# Altium schematic sheet A200T FPGA.SchDoc
size A1; SheetNumber: 3; SheetTotal: 3
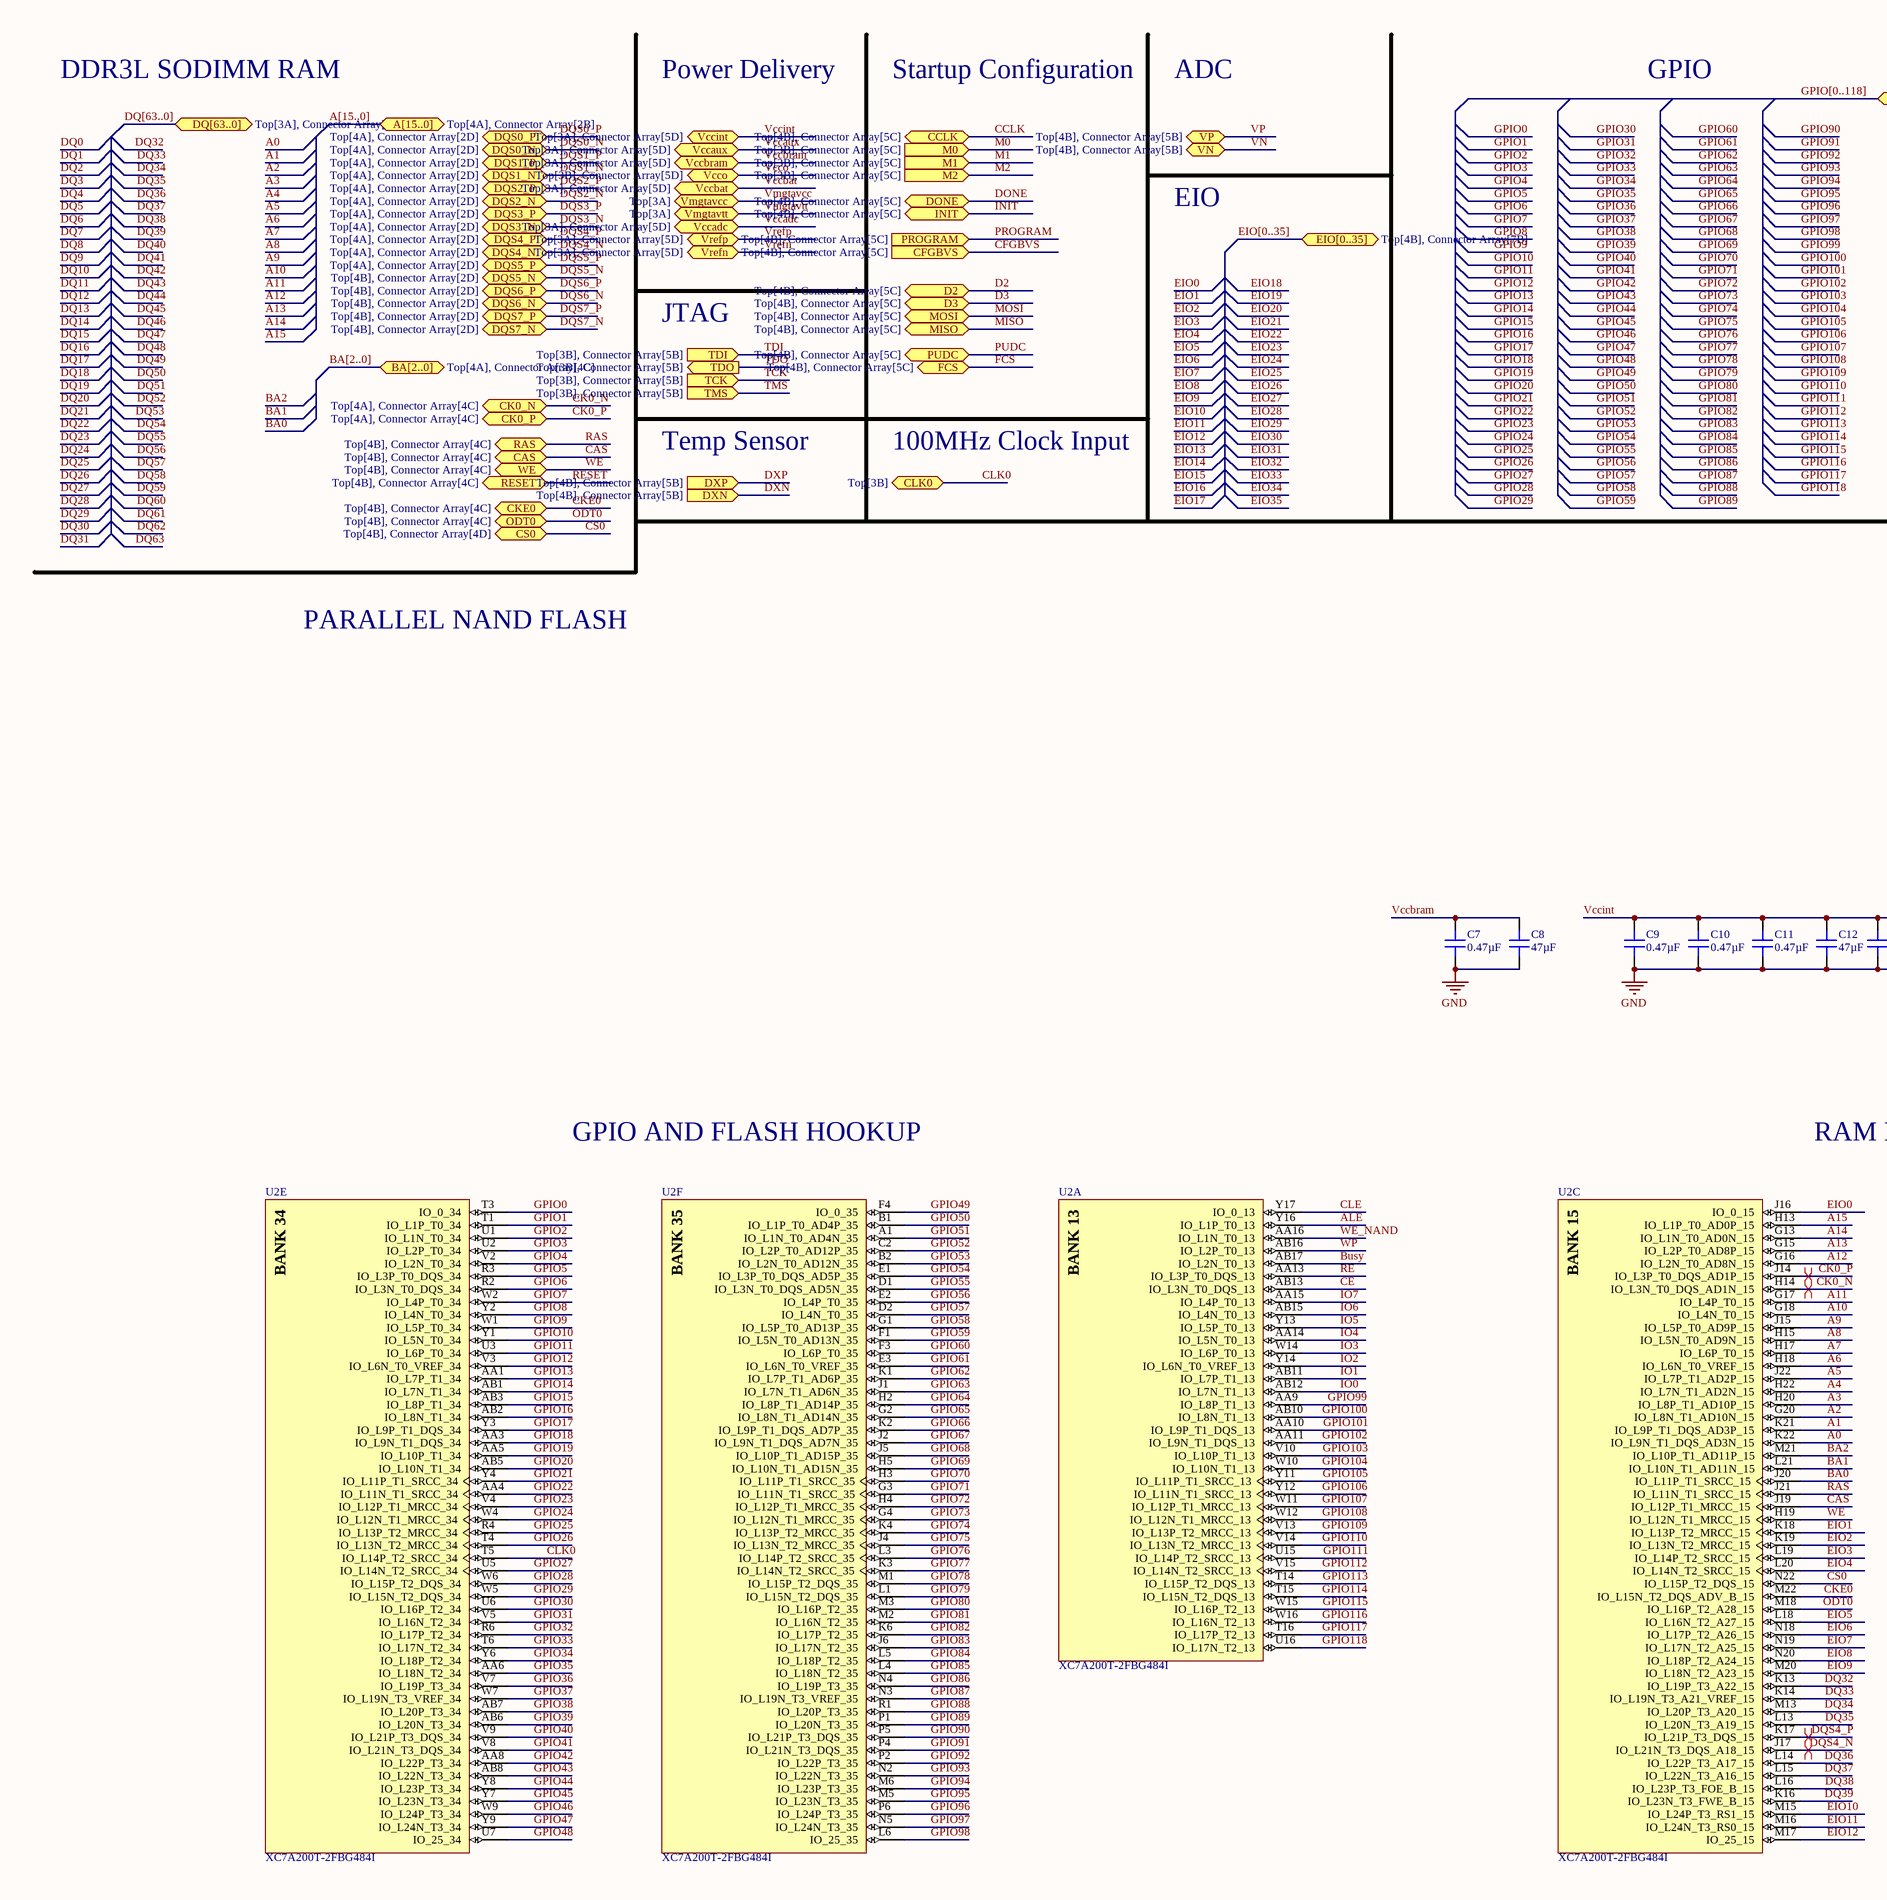
[diagram p0: A200T FPGA.SchDoc, left]
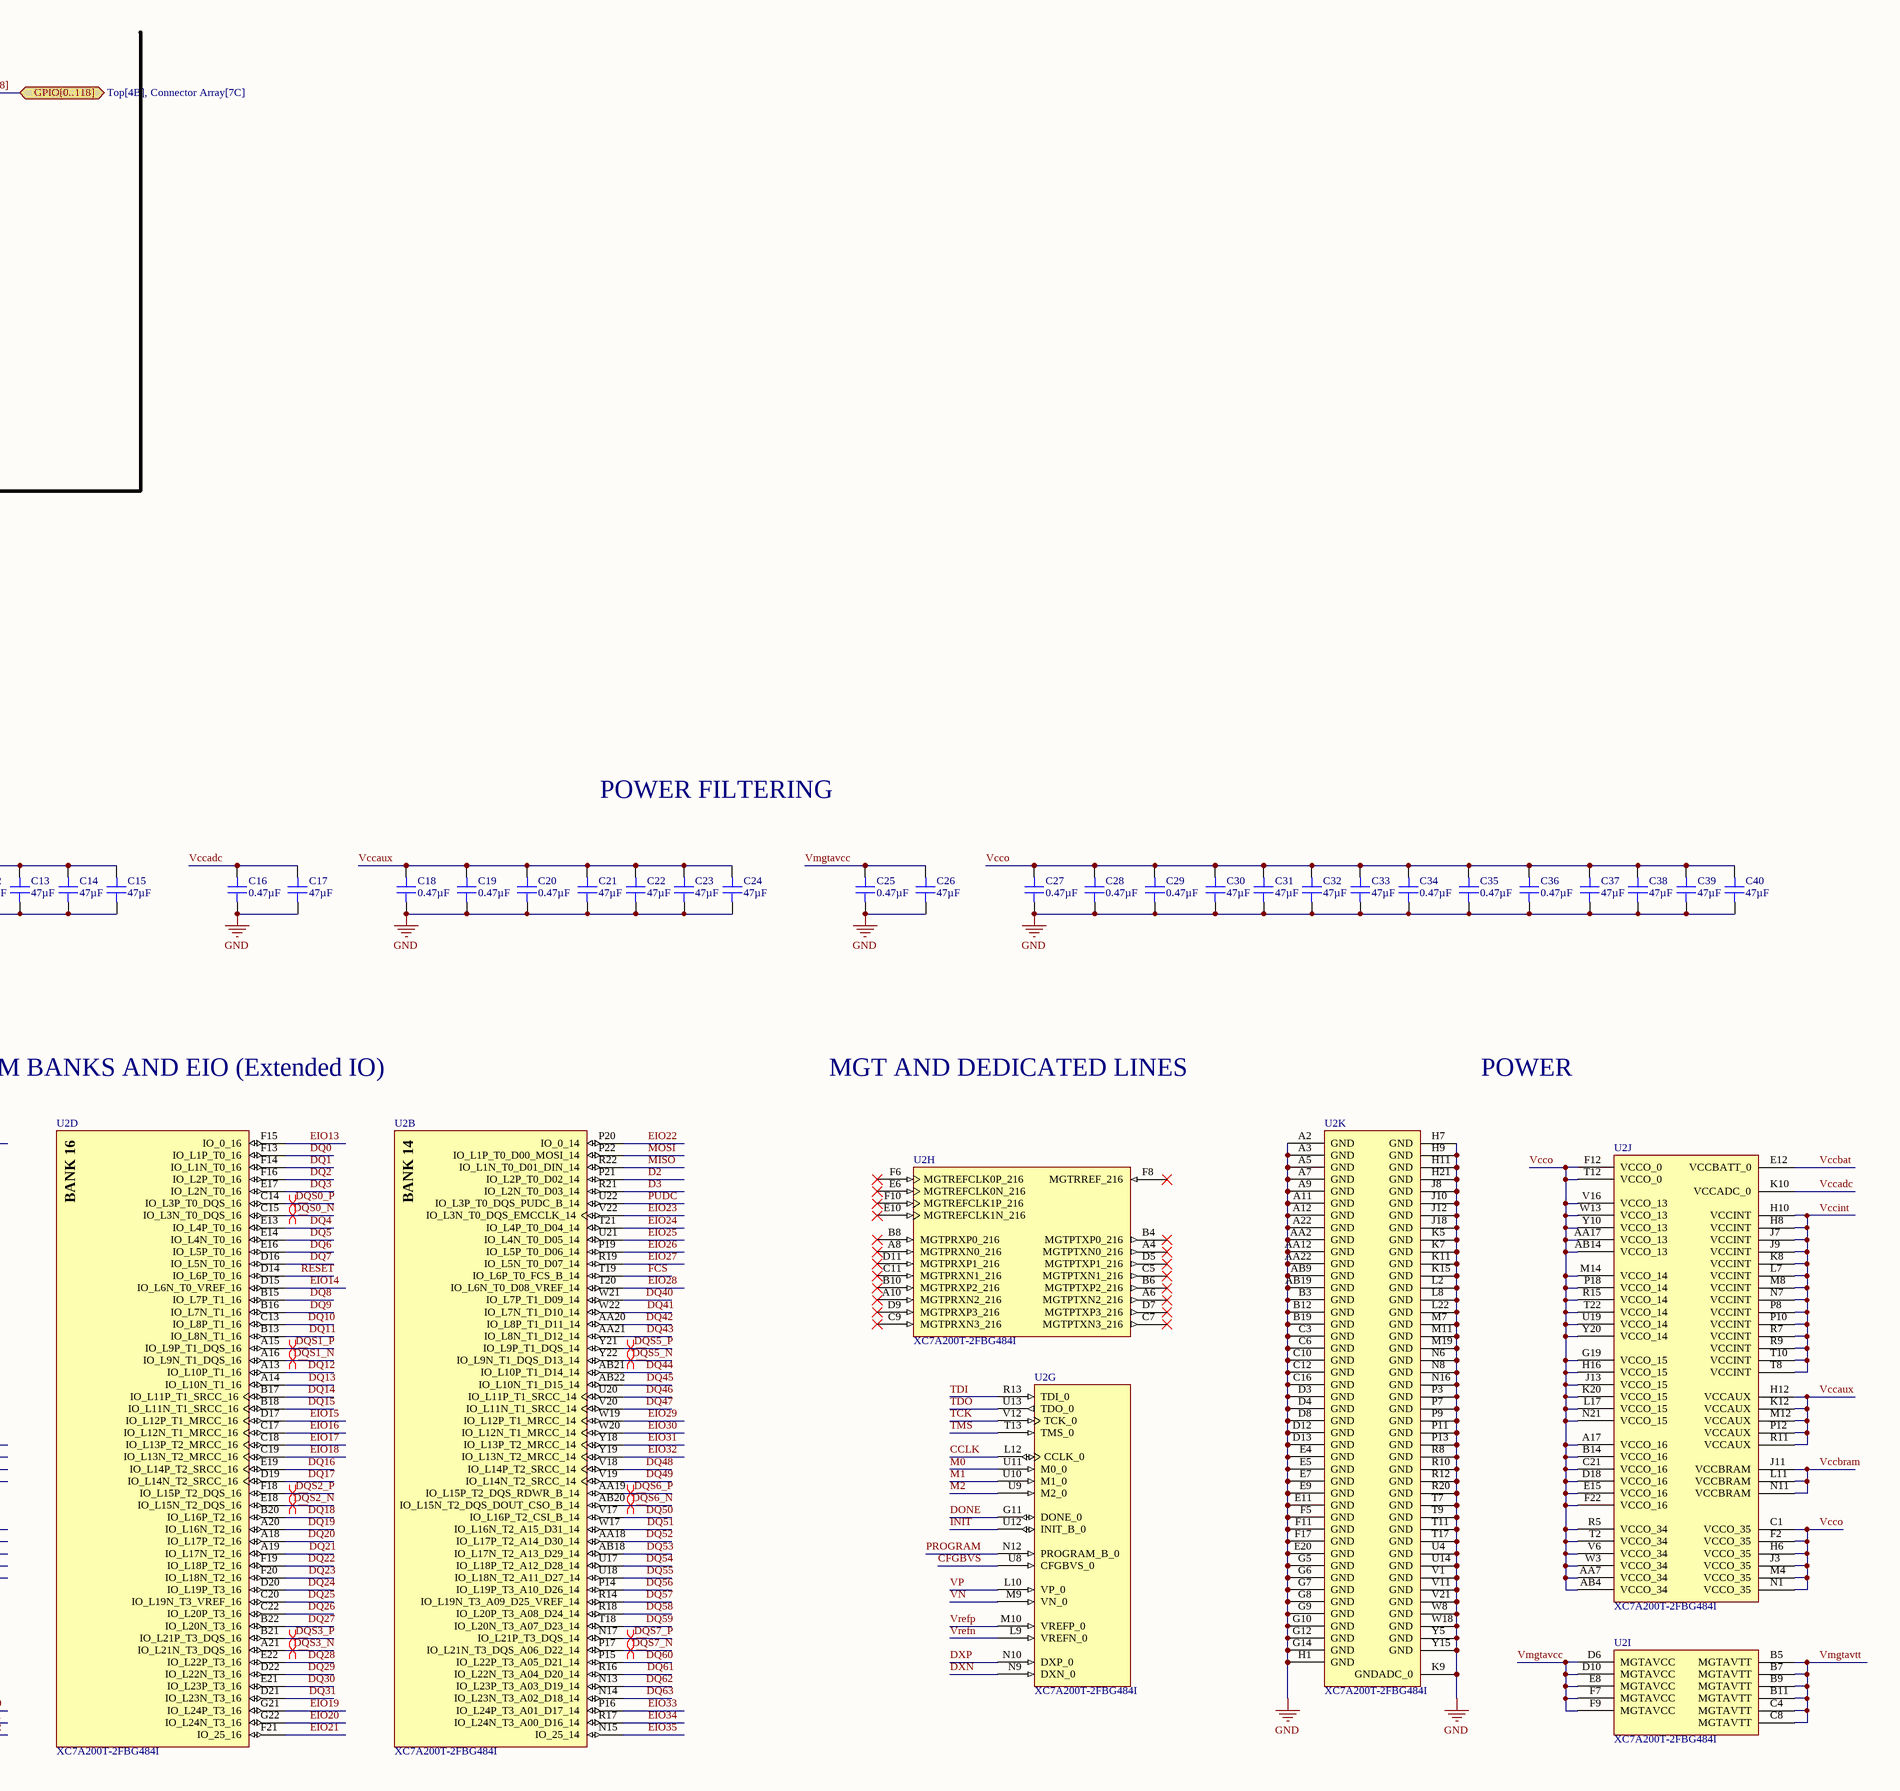
[diagram p1: A200T FPGA.SchDoc, right]

## Parts
C7  0.47µF  [CAP 0603_1608]
C8  47µF  [CAP 0805_2012]
C9  0.47µF  [CAP 0603_1608]
C10  0.47µF  [CAP 0603_1608]
C11  0.47µF  [CAP 0603_1608]
C12  47µF  [CAP 0805_2012]
C13  47µF  [CAP 0805_2012]
C14  47µF  [CAP 0805_2012]
C15  47µF  [CAP 0805_2012]
C16  0.47µF  [CAP 0603_1608]
C17  47µF  [CAP 0805_2012]
C18  0.47µF  [CAP 0603_1608]
C19  0.47µF  [CAP 0603_1608]
C20  0.47µF  [CAP 0603_1608]
C21  47µF  [CAP 0805_2012]
C22  47µF  [CAP 0805_2012]
C23  47µF  [CAP 0805_2012]
C24  47µF  [CAP 0805_2012]
C25  0.47µF  [CAP 0603_1608]
C26  47µF  [CAP 0805_2012]
C27  0.47µF  [CAP 0603_1608]
C28  0.47µF  [CAP 0603_1608]
C29  0.47µF  [CAP 0603_1608]
C30  47µF  [CAP 0805_2012]
C31  47µF  [CAP 0805_2012]
C32  47µF  [CAP 0805_2012]
C33  47µF  [CAP 0805_2012]
C34  0.47µF  [CAP 0603_1608]
C35  0.47µF  [CAP 0603_1608]
C36  0.47µF  [CAP 0603_1608]
C37  47µF  [CAP 0805_2012]
C38  47µF  [CAP 0805_2012]
C39  47µF  [CAP 0805_2012]
C40  47µF  [CAP 0805_2012]
U2  XC7A200T-2FBG484I  [FBG484]  (parts A,B,C,D,E,F,G,H,I,J,K of 11)

## Ports
A[15..0] (bidir, see Top[4A], Connector Array[2B]), BA[2..0] (bidir, see Top[4A], Connector Array[4C]), CAS (bidir, see Top[4B], Connector Array[4C]), CCLK (bidir, see Top[4B], Connector Array[5C]), CFGBVS (in, see Top[4B], Connector Array[5C]), CK0_N (bidir, see Top[4A], Connector Array[4C]), CK0_P (bidir, see Top[4A], Connector Array[4C]), CKE0 (bidir, see Top[4B], Connector Array[4C]), CLK0 (bidir, see Top[3B]), CS0 (bidir, see Top[4B], Connector Array[4D]), D2 (bidir, see Top[4B], Connector Array[5C]), D3 (bidir, see Top[4B], Connector Array[5C]), DONE (bidir, see Top[4B], Connector Array[5C]), DQ[63..0] (bidir, see Top[3A], Connector Array[2C]), DQS0_N (bidir, see Top[4A], Connector Array[2D]), DQS0_P (bidir, see Top[4A], Connector Array[2D]), DQS1_N (bidir, see Top[4A], Connector Array[2D]), DQS1_P (bidir, see Top[4A], Connector Array[2D]), DQS2_N (bidir, see Top[4A], Connector Array[2D]), DQS2_P (bidir, see Top[4A], Connector Array[2D]), DQS3_N (bidir, see Top[4A], Connector Array[2D]), DQS3_P (bidir, see Top[4A], Connector Array[2D]), DQS4_N (bidir, see Top[4A], Connector Array[2D]), DQS4_P (bidir, see Top[4A], Connector Array[2D]), DQS5_N (bidir, see Top[4B], Connector Array[2D]), DQS5_P (bidir, see Top[4A], Connector Array[2D]), DQS6_N (bidir, see Top[4B], Connector Array[2D]), DQS6_P (bidir, see Top[4B], Connector Array[2D]), DQS7_N (bidir, see Top[4B], Connector Array[2D]), DQS7_P (bidir, see Top[4B], Connector Array[2D]), DXN (in, see Top[4B], Connector Array[5B]), DXP (in, see Top[4B], Connector Array[5B]), EIO[0..35] (bidir, see Top[4B], Connector Array[7B]), FCS (bidir, see Top[4B], Connector Array[5C]), GPIO[0..118] (bidir, see Top[4B], Connector Array[7C]), INIT (bidir, see Top[4B], Connector Array[5C]), M0 (in, see Top[3B], Connector Array[5C]), M1 (in, see Top[3B], Connector Array[5C]), M2 (in, see Top[3B], Connector Array[5C]), MISO (bidir, see Top[4B], Connector Array[5C]), MOSI (bidir, see Top[4B], Connector Array[5C]), ODT0 (bidir, see Top[4B], Connector Array[4C]), PROGRAM (in, see Top[4B], Connector Array[5C]), PUDC (bidir, see Top[4B], Connector Array[5C]), RAS (bidir, see Top[4B], Connector Array[4C]), RESET (bidir, see Top[4B], Connector Array[4C]), TCK (in, see Top[3B], Connector Array[5B]), TDI (in, see Top[3B], Connector Array[5B]), TDO (out, see Top[3B], Connector Array[5B]), TMS (in, see Top[3B], Connector Array[5B]), Vccadc (bidir, see Top[3A], Connector Array[5D]), Vccaux (bidir, see Top[3A], Connector Array[5D]), Vccbat (bidir, see Top[3A], Connector Array[5D]), Vccbram (bidir, see Top[3A], Connector Array[5D]), Vccint (bidir, see Top[3A], Connector Array[5D]), Vcco (bidir, see Top[3B], Connector Array[5D]), Vmgtavcc (bidir, see Top[3A]), Vmgtavtt (bidir, see Top[3A]), VN (bidir, see Top[4B], Connector Array[5B]), VP (bidir, see Top[4B], Connector Array[5B]), Vrefn (bidir, see Top[3A], Connector Array[5D]), Vrefp (bidir, see Top[3A], Connector Array[5D]), WE (bidir, see Top[4B], Connector Array[4C])

## Nets
GND: C7.1 C8.1 C9.1 C10.1 C11.1 C12.1 C13.1 C14.1 C15.1 C16.1 C17.1 C18.1 C19.1 C20.1 C21.1 C22.1 C23.1 C24.1 C25.1 C26.1 C27.1 C28.1 C29.1 C30.1 C31.1 C32.1 C33.1 C34.1 C35.1 C36.1 C37.1 C38.1 C39.1 C40.1 U2.A2(GND) U2.A3(GND) U2.A5(GND) U2.A7(GND) U2.A9(GND) U2.A11(GND) U2.A12(GND) U2.A22(GND) U2.AA2(GND) U2.AA12(GND) U2.AA22(GND) U2.AB9(GND) U2.AB19(GND) U2.B3(GND) U2.B12(GND) U2.B19(GND) U2.C3(GND) U2.C6(GND) U2.C10(GND) U2.C12(GND) U2.C16(GND) U2.D3(GND) U2.D4(GND) U2.D8(GND) U2.D12(GND) U2.D13(GND) U2.E4(GND) U2.E5(GND) U2.E7(GND) U2.E9(GND) U2.E11(GND) U2.E20(GND) U2.F5(GND) U2.F11(GND) U2.F17(GND) U2.G5(GND) U2.G6(GND) U2.G7(GND) U2.G8(GND) U2.G9(GND) U2.G10(GND) U2.G12(GND) U2.G14(GND) U2.H1(GND) U2.H7(GND) U2.H9(GND) U2.H11(GND) U2.H21(GND) U2.J8(GND) U2.J10(GND) U2.J12(GND) U2.J18(GND) U2.K5(GND) U2.K7(GND) U2.K9(GNDADC_0) U2.K11(GND) U2.K15(GND) U2.L2(GND) U2.L8(GND) U2.L22(GND) U2.M7(GND) U2.M11(GND) U2.M19(GND) U2.N6(GND) U2.N8(GND) U2.N16(GND) U2.P3(GND) U2.P7(GND) U2.P9(GND) U2.P11(GND) U2.P13(GND) U2.R8(GND) U2.R10(GND) U2.R12(GND) U2.R20(GND) U2.T7(GND) U2.T9(GND) U2.T11(GND) U2.T17(GND) U2.U4(GND) U2.U14(GND) U2.V1(GND) U2.V11(GND) U2.V21(GND) U2.W8(GND) U2.W18(GND) U2.Y5(GND) U2.Y15(GND)
A0: U2.K22(IO_L9N_T1_DQS_AD3N_15)
A1: U2.K21(IO_L9P_T1_DQS_AD3P_15)
A2: U2.G20(IO_L8N_T1_AD10N_15)
A3: U2.H20(IO_L8P_T1_AD10P_15)
A4: U2.H22(IO_L7N_T1_AD2N_15)
A5: U2.J22(IO_L7P_T1_AD2P_15)
A6: U2.H18(IO_L6N_T0_VREF_15)
A7: U2.H17(IO_L6P_T0_15)
A8: U2.H15(IO_L5N_T0_AD9N_15)
A9: U2.J15(IO_L5P_T0_AD9P_15)
A10: U2.G18(IO_L4N_T0_15)
A11: U2.G17(IO_L4P_T0_15)
A12: U2.G16(IO_L2N_T0_AD8N_15)
A13: U2.G15(IO_L2P_T0_AD8P_15)
A14: U2.G13(IO_L1N_T0_AD0N_15)
A15: U2.H13(IO_L1P_T0_AD0P_15)
ALE: U2.Y16(IO_L1P_T0_13)
BA0: U2.J20(IO_L11P_T1_SRCC_15)
BA1: U2.L21(IO_L10N_T1_AD11N_15)
BA2: U2.M21(IO_L10P_T1_AD11P_15)
Busy: U2.AB17(IO_L2N_T0_13)
CAS: U2.J19(IO_L12P_T1_MRCC_15) ; port CAS
CCLK: U2.L12(CCLK_0) ; port CCLK
CE: U2.AB13(IO_L3N_T0_DQS_13)
CFGBVS: U2.U8(CFGBVS_0) ; port CFGBVS
CK0_N: U2.H14(IO_L3N_T0_DQS_AD1N_15) ; port CK0_N
CK0_P: U2.J14(IO_L3P_T0_DQS_AD1P_15) ; port CK0_P
CKE0: U2.M22(IO_L15N_T2_DQS_ADV_B_15) ; port CKE0
CLE: U2.Y17(IO_0_13)
CLK0: U2.T5(IO_L14P_T2_SRCC_34) ; port CLK0
CS0: U2.N22(IO_L15P_T2_DQS_15) ; port CS0
D2: U2.P21(IO_L2P_T0_D02_14) ; port D2
D3: U2.R21(IO_L2N_T0_D03_14) ; port D3
DONE: U2.G11(DONE_0) ; port DONE
DQ0: U2.F13(IO_L1P_T0_16)
DQ1: U2.F14(IO_L1N_T0_16)
DQ2: U2.F16(IO_L2P_T0_16)
DQ3: U2.E17(IO_L2N_T0_16)
DQ4: U2.E13(IO_L4P_T0_16)
DQ5: U2.E14(IO_L4N_T0_16)
DQ6: U2.E16(IO_L5P_T0_16)
DQ7: U2.D16(IO_L5N_T0_16)
DQ8: U2.B15(IO_L7P_T1_16)
DQ9: U2.B16(IO_L7N_T1_16)
DQ10: U2.C13(IO_L8P_T1_16)
DQ11: U2.B13(IO_L8N_T1_16)
DQ12: U2.A13(IO_L10P_T1_16)
DQ13: U2.A14(IO_L10N_T1_16)
DQ14: U2.B17(IO_L11P_T1_SRCC_16)
DQ15: U2.B18(IO_L11N_T1_SRCC_16)
DQ16: U2.E19(IO_L14P_T2_SRCC_16)
DQ17: U2.D19(IO_L14N_T2_SRCC_16)
DQ18: U2.B20(IO_L16P_T2_16)
DQ19: U2.A20(IO_L16N_T2_16)
DQ20: U2.A18(IO_L17P_T2_16)
DQ21: U2.A19(IO_L17N_T2_16)
DQ22: U2.F19(IO_L18P_T2_16)
DQ23: U2.F20(IO_L18N_T2_16)
DQ24: U2.D20(IO_L19P_T3_16)
DQ25: U2.C20(IO_L19N_T3_VREF_16)
DQ26: U2.C22(IO_L20P_T3_16)
DQ27: U2.B22(IO_L20N_T3_16)
DQ28: U2.E22(IO_L22P_T3_16)
DQ29: U2.D22(IO_L22N_T3_16)
DQ30: U2.E21(IO_L23P_T3_16)
DQ31: U2.D21(IO_L23N_T3_16)
DQ32: U2.K13(IO_L19P_T3_A22_15)
DQ33: U2.K14(IO_L19N_T3_A21_VREF_15)
DQ34: U2.M13(IO_L20P_T3_A20_15)
DQ35: U2.L13(IO_L20N_T3_A19_15)
DQ36: U2.L14(IO_L22P_T3_A17_15)
DQ37: U2.L15(IO_L22N_T3_A16_15)
DQ38: U2.L16(IO_L23P_T3_FOE_B_15)
DQ39: U2.K16(IO_L23N_T3_FWE_B_15)
DQ40: U2.W21(IO_L7P_T1_D09_14)
DQ41: U2.W22(IO_L7N_T1_D10_14)
DQ42: U2.AA20(IO_L8P_T1_D11_14)
DQ43: U2.AA21(IO_L8N_T1_D12_14)
DQ44: U2.AB21(IO_L10P_T1_D14_14)
DQ45: U2.AB22(IO_L10N_T1_D15_14)
DQ46: U2.U20(IO_L11P_T1_SRCC_14)
DQ47: U2.V20(IO_L11N_T1_SRCC_14)
DQ48: U2.V18(IO_L14P_T2_SRCC_14)
DQ49: U2.V19(IO_L14N_T2_SRCC_14)
DQ50: U2.V17(IO_L16P_T2_CSI_B_14)
DQ51: U2.W17(IO_L16N_T2_A15_D31_14)
DQ52: U2.AA18(IO_L17P_T2_A14_D30_14)
DQ53: U2.AB18(IO_L17N_T2_A13_D29_14)
DQ54: U2.U17(IO_L18P_T2_A12_D28_14)
DQ55: U2.U18(IO_L18N_T2_A11_D27_14)
DQ56: U2.P14(IO_L19P_T3_A10_D26_14)
DQ57: U2.R14(IO_L19N_T3_A09_D25_VREF_14)
DQ58: U2.R18(IO_L20P_T3_A08_D24_14)
DQ59: U2.T18(IO_L20N_T3_A07_D23_14)
DQ60: U2.P15(IO_L22P_T3_A05_D21_14)
DQ61: U2.R16(IO_L22N_T3_A04_D20_14)
DQ62: U2.N13(IO_L23P_T3_A03_D19_14)
DQ63: U2.N14(IO_L23N_T3_A02_D18_14)
DQS0_N: U2.C15(IO_L3N_T0_DQS_16) ; port DQS0_N
DQS0_P: U2.C14(IO_L3P_T0_DQS_16) ; port DQS0_P
DQS1_N: U2.A16(IO_L9N_T1_DQS_16) ; port DQS1_N
DQS1_P: U2.A15(IO_L9P_T1_DQS_16) ; port DQS1_P
DQS2_N: U2.E18(IO_L15N_T2_DQS_16) ; port DQS2_N
DQS2_P: U2.F18(IO_L15P_T2_DQS_16) ; port DQS2_P
DQS3_N: U2.A21(IO_L21N_T3_DQS_16) ; port DQS3_N
DQS3_P: U2.B21(IO_L21P_T3_DQS_16) ; port DQS3_P
DQS4_N: U2.J17(IO_L21N_T3_DQS_A18_15) ; port DQS4_N
DQS4_P: U2.K17(IO_L21P_T3_DQS_15) ; port DQS4_P
DQS5_N: U2.Y22(IO_L9N_T1_DQS_D13_14) ; port DQS5_N
DQS5_P: U2.Y21(IO_L9P_T1_DQS_14) ; port DQS5_P
DQS6_N: U2.AB20(IO_L15N_T2_DQS_DOUT_CSO_B_14) ; port DQS6_N
DQS6_P: U2.AA19(IO_L15P_T2_DQS_RDWR_B_14) ; port DQS6_P
DQS7_N: U2.P17(IO_L21N_T3_DQS_A06_D22_14) ; port DQS7_N
DQS7_P: U2.N17(IO_L21P_T3_DQS_14) ; port DQS7_P
DXN: U2.N9(DXN_0) ; port DXN
DXP: U2.N10(DXP_0) ; port DXP
EIO0: U2.J16(IO_0_15)
EIO1: U2.K18(IO_L13P_T2_MRCC_15)
EIO2: U2.K19(IO_L13N_T2_MRCC_15)
EIO3: U2.L19(IO_L14P_T2_SRCC_15)
EIO4: U2.L20(IO_L14N_T2_SRCC_15)
EIO5: U2.L18(IO_L16N_T2_A27_15)
EIO6: U2.N18(IO_L17P_T2_A26_15)
EIO7: U2.N19(IO_L17N_T2_A25_15)
EIO8: U2.N20(IO_L18P_T2_A24_15)
EIO9: U2.M20(IO_L18N_T2_A23_15)
EIO10: U2.M15(IO_L24P_T3_RS1_15)
EIO11: U2.M16(IO_L24N_T3_RS0_15)
EIO12: U2.M17(IO_25_15)
EIO13: U2.F15(IO_0_16)
EIO14: U2.D15(IO_L6N_T0_VREF_16)
EIO15: U2.D17(IO_L12P_T1_MRCC_16)
EIO16: U2.C17(IO_L12N_T1_MRCC_16)
EIO17: U2.C18(IO_L13P_T2_MRCC_16)
EIO18: U2.C19(IO_L13N_T2_MRCC_16)
EIO19: U2.G21(IO_L24P_T3_16)
EIO20: U2.G22(IO_L24N_T3_16)
EIO21: U2.F21(IO_25_16)
EIO22: U2.P20(IO_0_14)
EIO23: U2.V22(IO_L3N_T0_DQS_EMCCLK_14)
EIO24: U2.T21(IO_L4P_T0_D04_14)
EIO25: U2.U21(IO_L4N_T0_D05_14)
EIO26: U2.P19(IO_L5P_T0_D06_14)
EIO27: U2.R19(IO_L5N_T0_D07_14)
EIO28: U2.T20(IO_L6N_T0_D08_VREF_14)
EIO29: U2.W19(IO_L12P_T1_MRCC_14)
EIO30: U2.W20(IO_L12N_T1_MRCC_14)
EIO31: U2.Y18(IO_L13P_T2_MRCC_14)
EIO32: U2.Y19(IO_L13N_T2_MRCC_14)
EIO33: U2.P16(IO_L24P_T3_A01_D17_14)
EIO34: U2.R17(IO_L24N_T3_A00_D16_14)
EIO35: U2.N15(IO_25_14)
FCS: U2.T19(IO_L6P_T0_FCS_B_14) ; port FCS
GPIO0: U2.T3(IO_0_34)
GPIO1: U2.T1(IO_L1P_T0_34)
GPIO2: U2.U1(IO_L1N_T0_34)
GPIO3: U2.U2(IO_L2P_T0_34)
GPIO4: U2.V2(IO_L2N_T0_34)
GPIO5: U2.R3(IO_L3P_T0_DQS_34)
GPIO6: U2.R2(IO_L3N_T0_DQS_34)
GPIO7: U2.W2(IO_L4P_T0_34)
GPIO8: U2.Y2(IO_L4N_T0_34)
GPIO9: U2.W1(IO_L5P_T0_34)
GPIO10: U2.Y1(IO_L5N_T0_34)
GPIO11: U2.U3(IO_L6P_T0_34)
GPIO12: U2.V3(IO_L6N_T0_VREF_34)
GPIO13: U2.AA1(IO_L7P_T1_34)
GPIO14: U2.AB1(IO_L7N_T1_34)
GPIO15: U2.AB3(IO_L8P_T1_34)
GPIO16: U2.AB2(IO_L8N_T1_34)
GPIO17: U2.Y3(IO_L9P_T1_DQS_34)
GPIO18: U2.AA3(IO_L9N_T1_DQS_34)
GPIO19: U2.AA5(IO_L10P_T1_34)
GPIO20: U2.AB5(IO_L10N_T1_34)
GPIO21: U2.Y4(IO_L11P_T1_SRCC_34)
GPIO22: U2.AA4(IO_L11N_T1_SRCC_34)
GPIO23: U2.V4(IO_L12P_T1_MRCC_34)
GPIO24: U2.W4(IO_L12N_T1_MRCC_34)
GPIO25: U2.R4(IO_L13P_T2_MRCC_34)
GPIO26: U2.T4(IO_L13N_T2_MRCC_34)
GPIO27: U2.U5(IO_L14N_T2_SRCC_34)
GPIO28: U2.W6(IO_L15P_T2_DQS_34)
GPIO29: U2.W5(IO_L15N_T2_DQS_34)
GPIO30: U2.U6(IO_L16P_T2_34)
GPIO31: U2.V5(IO_L16N_T2_34)
GPIO32: U2.R6(IO_L17P_T2_34)
GPIO33: U2.T6(IO_L17N_T2_34)
GPIO34: U2.Y6(IO_L18P_T2_34)
GPIO35: U2.AA6(IO_L18N_T2_34)
GPIO36: U2.V7(IO_L19P_T3_34)
GPIO37: U2.W7(IO_L19N_T3_VREF_34)
GPIO38: U2.AB7(IO_L20P_T3_34)
GPIO39: U2.AB6(IO_L20N_T3_34)
GPIO40: U2.V9(IO_L21P_T3_DQS_34)
GPIO41: U2.V8(IO_L21N_T3_DQS_34)
GPIO42: U2.AA8(IO_L22P_T3_34)
GPIO43: U2.AB8(IO_L22N_T3_34)
GPIO44: U2.Y8(IO_L23P_T3_34)
GPIO45: U2.Y7(IO_L23N_T3_34)
GPIO46: U2.W9(IO_L24P_T3_34)
GPIO47: U2.Y9(IO_L24N_T3_34)
GPIO48: U2.U7(IO_25_34)
GPIO49: U2.F4(IO_0_35)
GPIO50: U2.B1(IO_L1P_T0_AD4P_35)
GPIO51: U2.A1(IO_L1N_T0_AD4N_35)
GPIO52: U2.C2(IO_L2P_T0_AD12P_35)
GPIO53: U2.B2(IO_L2N_T0_AD12N_35)
GPIO54: U2.E1(IO_L3P_T0_DQS_AD5P_35)
GPIO55: U2.D1(IO_L3N_T0_DQS_AD5N_35)
GPIO56: U2.E2(IO_L4P_T0_35)
GPIO57: U2.D2(IO_L4N_T0_35)
GPIO58: U2.G1(IO_L5P_T0_AD13P_35)
GPIO59: U2.F1(IO_L5N_T0_AD13N_35)
GPIO60: U2.F3(IO_L6P_T0_35)
GPIO61: U2.E3(IO_L6N_T0_VREF_35)
GPIO62: U2.K1(IO_L7P_T1_AD6P_35)
GPIO63: U2.J1(IO_L7N_T1_AD6N_35)
GPIO64: U2.H2(IO_L8P_T1_AD14P_35)
GPIO65: U2.G2(IO_L8N_T1_AD14N_35)
GPIO66: U2.K2(IO_L9P_T1_DQS_AD7P_35)
GPIO67: U2.J2(IO_L9N_T1_DQS_AD7N_35)
GPIO68: U2.J5(IO_L10P_T1_AD15P_35)
GPIO69: U2.H5(IO_L10N_T1_AD15N_35)
GPIO70: U2.H3(IO_L11P_T1_SRCC_35)
GPIO71: U2.G3(IO_L11N_T1_SRCC_35)
GPIO72: U2.H4(IO_L12P_T1_MRCC_35)
GPIO73: U2.G4(IO_L12N_T1_MRCC_35)
GPIO74: U2.K4(IO_L13P_T2_MRCC_35)
GPIO75: U2.J4(IO_L13N_T2_MRCC_35)
GPIO76: U2.L3(IO_L14P_T2_SRCC_35)
GPIO77: U2.K3(IO_L14N_T2_SRCC_35)
GPIO78: U2.M1(IO_L15P_T2_DQS_35)
GPIO79: U2.L1(IO_L15N_T2_DQS_35)
GPIO80: U2.M3(IO_L16P_T2_35)
GPIO81: U2.M2(IO_L16N_T2_35)
GPIO82: U2.K6(IO_L17P_T2_35)
GPIO83: U2.J6(IO_L17N_T2_35)
GPIO84: U2.L5(IO_L18P_T2_35)
GPIO85: U2.L4(IO_L18N_T2_35)
GPIO86: U2.N4(IO_L19P_T3_35)
GPIO87: U2.N3(IO_L19N_T3_VREF_35)
GPIO88: U2.R1(IO_L20P_T3_35)
GPIO89: U2.P1(IO_L20N_T3_35)
GPIO90: U2.P5(IO_L21P_T3_DQS_35)
GPIO91: U2.P4(IO_L21N_T3_DQS_35)
GPIO92: U2.P2(IO_L22P_T3_35)
GPIO93: U2.N2(IO_L22N_T3_35)
GPIO94: U2.M6(IO_L23P_T3_35)
GPIO95: U2.M5(IO_L23N_T3_35)
GPIO96: U2.P6(IO_L24P_T3_35)
GPIO97: U2.N5(IO_L24N_T3_35)
GPIO98: U2.L6(IO_25_35)
GPIO99: U2.AA9(IO_L8P_T1_13)
GPIO100: U2.AB10(IO_L8N_T1_13)
GPIO101: U2.AA10(IO_L9P_T1_DQS_13)
GPIO102: U2.AA11(IO_L9N_T1_DQS_13)
GPIO103: U2.V10(IO_L10P_T1_13)
GPIO104: U2.W10(IO_L10N_T1_13)
GPIO105: U2.Y11(IO_L11P_T1_SRCC_13)
GPIO106: U2.Y12(IO_L11N_T1_SRCC_13)
GPIO107: U2.W11(IO_L12P_T1_MRCC_13)
GPIO108: U2.W12(IO_L12N_T1_MRCC_13)
GPIO109: U2.V13(IO_L13P_T2_MRCC_13)
GPIO110: U2.V14(IO_L13N_T2_MRCC_13)
GPIO111: U2.U15(IO_L14P_T2_SRCC_13)
GPIO112: U2.V15(IO_L14N_T2_SRCC_13)
GPIO113: U2.T14(IO_L15P_T2_DQS_13)
GPIO114: U2.T15(IO_L15N_T2_DQS_13)
GPIO115: U2.W15(IO_L16P_T2_13)
GPIO116: U2.W16(IO_L16N_T2_13)
GPIO117: U2.T16(IO_L17P_T2_13)
GPIO118: U2.U16(IO_L17N_T2_13)
INIT: U2.U12(INIT_B_0) ; port INIT
IO0: U2.AB12(IO_L7N_T1_13)
IO1: U2.AB11(IO_L7P_T1_13)
IO2: U2.Y14(IO_L6N_T0_VREF_13)
IO3: U2.W14(IO_L6P_T0_13)
IO4: U2.AA14(IO_L5N_T0_13)
IO5: U2.Y13(IO_L5P_T0_13)
IO6: U2.AB15(IO_L4N_T0_13)
IO7: U2.AA15(IO_L4P_T0_13)
M0: U2.U11(M0_0) ; port M0
M1: U2.U10(M1_0) ; port M1
M2: U2.U9(M2_0) ; port M2
MISO: U2.R22(IO_L1N_T0_D01_DIN_14) ; port MISO
MOSI: U2.P22(IO_L1P_T0_D00_MOSI_14) ; port MOSI
ODT0: U2.M18(IO_L16P_T2_A28_15) ; port ODT0
PROGRAM: U2.N12(PROGRAM_B_0) ; port PROGRAM
PUDC: U2.U22(IO_L3P_T0_DQS_PUDC_B_14) ; port PUDC
RAS: U2.J21(IO_L11N_T1_SRCC_15) ; port RAS
RE: U2.AA13(IO_L3P_T0_DQS_13)
RESET: U2.D14(IO_L6P_T0_16) ; port RESET
TCK: U2.V12(TCK_0) ; port TCK
TDI: U2.R13(TDI_0) ; port TDI
TDO: U2.U13(TDO_0) ; port TDO
TMS: U2.T13(TMS_0) ; port TMS
Vccadc: C16.2 C17.2 U2.K10(VCCADC_0) ; port Vccadc
Vccaux: C18.2 C19.2 C20.2 C21.2 C22.2 C23.2 C24.2 U2.H12(VCCAUX) U2.K12(VCCAUX) U2.M12(VCCAUX) U2.P12(VCCAUX) U2.R11(VCCAUX) ; port Vccaux
Vccbat: U2.E12(VCCBATT_0) ; port Vccbat
Vccbram: C7.2 C8.2 U2.J11(VCCBRAM) U2.L11(VCCBRAM) U2.N11(VCCBRAM) ; port Vccbram
Vccint: C9.2 C10.2 C11.2 C12.2 C13.2 C14.2 C15.2 U2.H8(VCCINT) U2.H10(VCCINT) U2.J7(VCCINT) U2.J9(VCCINT) U2.K8(VCCINT) U2.L7(VCCINT) U2.M8(VCCINT) U2.N7(VCCINT) U2.P8(VCCINT) U2.P10(VCCINT) U2.R7(VCCINT) U2.R9(VCCINT) U2.T8(VCCINT) U2.T10(VCCINT) ; port Vccint
Vcco: C27.2 C28.2 C29.2 C30.2 C31.2 C32.2 C33.2 C34.2 C35.2 C36.2 C37.2 C38.2 C39.2 C40.2 U2.A17(VCCO_16) U2.AA7(VCCO_34) U2.AA17(VCCO_13) U2.AB4(VCCO_34) U2.AB14(VCCO_13) U2.B14(VCCO_16) U2.C1(VCCO_35) U2.C21(VCCO_16) U2.D18(VCCO_16) U2.E15(VCCO_16) U2.F2(VCCO_35) U2.F12(VCCO_0) U2.F22(VCCO_16) U2.G19(VCCO_15) U2.H6(VCCO_35) U2.H16(VCCO_15) U2.J3(VCCO_35) U2.J13(VCCO_15) U2.K20(VCCO_15) U2.L17(VCCO_15) U2.M4(VCCO_35) U2.M14(VCCO_14) U2.N1(VCCO_35) U2.N21(VCCO_15) U2.P18(VCCO_14) U2.R5(VCCO_34) U2.R15(VCCO_14) U2.T2(VCCO_34) U2.T12(VCCO_0) U2.T22(VCCO_14) U2.U19(VCCO_14) U2.V6(VCCO_34) U2.V16(VCCO_13) U2.W3(VCCO_34) U2.W13(VCCO_13) U2.Y10(VCCO_13) U2.Y20(VCCO_14) ; port Vcco
Vmgtavcc: C25.2 C26.2 U2.D6(MGTAVCC) U2.D10(MGTAVCC) U2.E8(MGTAVCC) U2.F7(MGTAVCC) U2.F9(MGTAVCC) ; port Vmgtavcc
Vmgtavtt: U2.B5(MGTAVTT) U2.B7(MGTAVTT) U2.B9(MGTAVTT) U2.B11(MGTAVTT) U2.C4(MGTAVTT) U2.C8(MGTAVTT) ; port Vmgtavtt
VN: U2.M9(VN_0) ; port VN
VP: U2.L10(VP_0) ; port VP
Vrefn: U2.L9(VREFN_0) ; port Vrefn
Vrefp: U2.M10(VREFP_0) ; port Vrefp
WE: U2.H19(IO_L12N_T1_MRCC_15) ; port WE
WE_NAND: U2.AA16(IO_L1N_T0_13)
WP: U2.AB16(IO_L2P_T0_13)

Not connected (* = marked no-connect by the designer): U2 A4(MGTPTXN0_216)* A6(MGTPTXN2_216)* A8(MGTPRXN0_216)* A10(MGTPRXN2_216)* B4(MGTPTXP0_216)* B6(MGTPTXP2_216)* B8(MGTPRXP0_216)* B10(MGTPRXP2_216)* C5(MGTPTXN1_216)* C7(MGTPTXN3_216)* C9(MGTPRXN3_216)* C11(MGTPRXN1_216)* D5(MGTPTXP1_216)* D7(MGTPTXP3_216)* D9(MGTPRXP3_216)* D11(MGTPRXP1_216)* E6(MGTREFCLK0N_216)* E10(MGTREFCLK1N_216)* F6(MGTREFCLK0P_216)* F8(MGTRREF_216)* F10(MGTREFCLK1P_216)*

## Buses and harness runs
bus A[15..0] = port A[15..0]
bus BA[2..0] = port BA[2..0]
bus DQ[63..0] = port DQ[63..0]
bus EIO[0..35] = port EIO[0..35]
bus GPIO[0..118] = port GPIO[0..118]

## Layout directives
differential pair: CK0_N, CK0_P, DQS0_N, DQS0_P, DQS1_N, DQS1_P, DQS2_N, DQS2_P, DQS3_N, DQS3_P, DQS4_N, DQS4_P, DQS5_N, DQS5_P, DQS6_N, DQS6_P, DQS7_N, DQS7_P

## Notes on the sheet
- DDR3L SODIMM RAM
- Power Delivery
- Startup Configuration
- ADC
- GPIO
- EIO
- JTAG
- Temp Sensor
- 100MHz Clock Input
- PARALLEL NAND FLASH
- POWER FILTERING
- GPIO AND FLASH HOOKUP
- RAM BANKS AND EIO (Extended IO)
- MGT AND DEDICATED LINES
- POWER
- (in symbol XC7A200T-2FBG484I, part A) BANK 13
- (in symbol XC7A200T-2FBG484I, part B) BANK 14
- (in symbol XC7A200T-2FBG484I, part C) BANK 15
- (in symbol XC7A200T-2FBG484I, part D) BANK 16
- (in symbol XC7A200T-2FBG484I, part E) BANK 34
- (in symbol XC7A200T-2FBG484I, part F) BANK 35

## Library data of the parts
C7 C9-C11 C16 C18-C20 C25 C27-C29 C34-C36 = 885012106015: CAP CER 0.47UF 16V X5R 0603; Manufacturer: Würth Elektronik; Tolerance: ±20%; Part Number: 885012106015; Value: 0.47µF; Applications: General Purpose; Capacitance: 0.47µF; ComponentLink1Description: Datasheet; ComponentLink1URL: https://katalog.we-online.de/pbs/datasheet/885012106015.pdf; ComponentLink2Description: DigiKey Link; ComponentLink2URL: http://digikey.com/product-detail/en/w-rth-elektronik/885012106015/732-7912-1-ND/5454539; Device Package: 0603 (1608 Metric); LastUpdated: 2020-09-02 1:03:18 AM; Lifecycle Status: Active; Minimum Order: 1; Mounting Type: Surface Mount, MLCC; Operating Temperature: -55°C ~ 85°C; Package / Case: 0603 (1608 Metric); Packaging: TapeAndReel; PartId: 11963; Part Status: Active; Price: 0.04; Series: WCAP-CSGP; Size / Dimension: 0.063" L x 0.031" W (1.60mm x 0.80mm); Supplier 1: DigiKey; Supplier Part Number 1: 732-7912-1-ND; Temperature Coefficient: X5R; Thickness (Max): 0.037" (0.95mm); Voltage - Rated: 16V
C8 C12-C15 C17 C21-C24 C26 C30-C33 C37-C40 = GRM21BR61A476ME15L: CAP CER 47UF 10V X5R 0805; Manufacturer: Murata Electronics; Tolerance: ±20%; Part Number: GRM21BR61A476ME15L; Value: 47µF; Applications: General Purpose; Capacitance: 47µF; ComponentLink1Description: Datasheet; ComponentLink1URL: https://search.murata.co.jp/Ceramy/image/img/A01X/G101/ENG/GRM21BR61A476ME15-01.pdf; ComponentLink2Description: DigiKey Link; ComponentLink2URL: http://digikey.com/product-detail/en/murata-electronics/GRM21BR61A476ME15L/490-9961-1-ND/5026442; Device Package: 0805 (2012 Metric); LastUpdated: 2020-09-02 1:04:38 AM; Lifecycle Status: Active; Minimum Order: 1; Mounting Type: Surface Mount, MLCC; Operating Temperature: -55°C ~ 85°C; Package / Case: 0805 (2012 Metric); Packaging: TapeAndReel; PartId: 4627; Part Status: Active; Price: 0.19; Series: GRM; Size / Dimension: 0.079" L x 0.049" W (2.00mm x 1.25mm); Supplier 1: DigiKey; Supplier Part Number 1: 490-9961-1-ND; Temperature Coefficient: X5R; Thickness (Max): 0.057" (1.45mm); Voltage - Rated: 10V
U2 = XC7A200T-2FBG484I: Artix-7 FPGA, 285 User I/Os, 4 GTP, 484-Ball BGA, Speed Grade 2, Industrial Grade, Pb-Free; Manufacturer: Xilinx; Block RAM Blocks (18Kb): 730; Block RAM Blocks (36Kb): 365; Block RAM Blocks (Max Kb): 13140; CLBs (Slices): 33650; Clock Mgmt Tiles (CMTs): 10; DSP48E1 Slices: 740; Logic Cells: 215360; Max User I/O: 500; Speed Grade: -2; DatasheetVersion: v1.12; PackageVersion: Rev 1.8; PackageReference: FBG484; PackageDescription: Flip-Chip Lidless BGA, Body 23 x 23 mm, 1.0 mm Pitch; Supplier 1: Digi-Key; Supplier Part Number 1: 122-1866-ND; CLBs (Max Distributed RAM Kb): 2888; Generic Part Number: XC7A200T; RoHS: Pb-Free; NexusDeviceID: XC7A200T-2FBG484I; Mounting Technology: Surface Mount; Code_JEDEC: MS-034; PartNumber: XC7A200T-2FBG484I; ComponentLink1Description: Manufacturer URL; ComponentLink1URL: http://www.xilinx.com/; ComponentLink2Description: Datasheet; ComponentLink2URL: http://www.xilinx.com/support/documentation/data_sheets/ds180_7Series_Overview.pdf; ComponentLink3Description: Package Specification; ComponentLink3URL: http://www.xilinx.com/support/documentation/user_guides/ug475_7Series_Pkg_Pinout.pdf; ComponentLink4Description: DC and Switching Characteristics; ComponentLink4URL: http://www.xilinx.com/support/documentation/data_sheets/ds181_Artix_7_Data_Sheet.pdf; ComponentLink5Description: Package File; ComponentLink5URL: http://www.xilinx.com/support/packagefiles/a7packages/xc7a200tfbg484pkg.txt; ComponentLink6Description: Packaging and Pinout; ComponentLink6URL: http://www.xilinx.com/support/documentation/user_guides/ug475_7Series_Pkg_Pinout.pdf